# Altium schematic sheet LED_aluminum.SchDoc: Sample Sheet Title
size B; Date: MM/DD/YYYY; Author: Sample Author; Organization: ORGANIZATION; Address1: ADDRESS 1; Address2: ADDRESS 2; Address3: ADDRESS 3; Address4: ADDRESS 4; Revision: -; SheetNumber: 1; SheetTotal: 1; ENG_APP_DATE: --/--/--; DSN_APP_DATE: --/--/--; CHK_APP_DATE: --/--/--
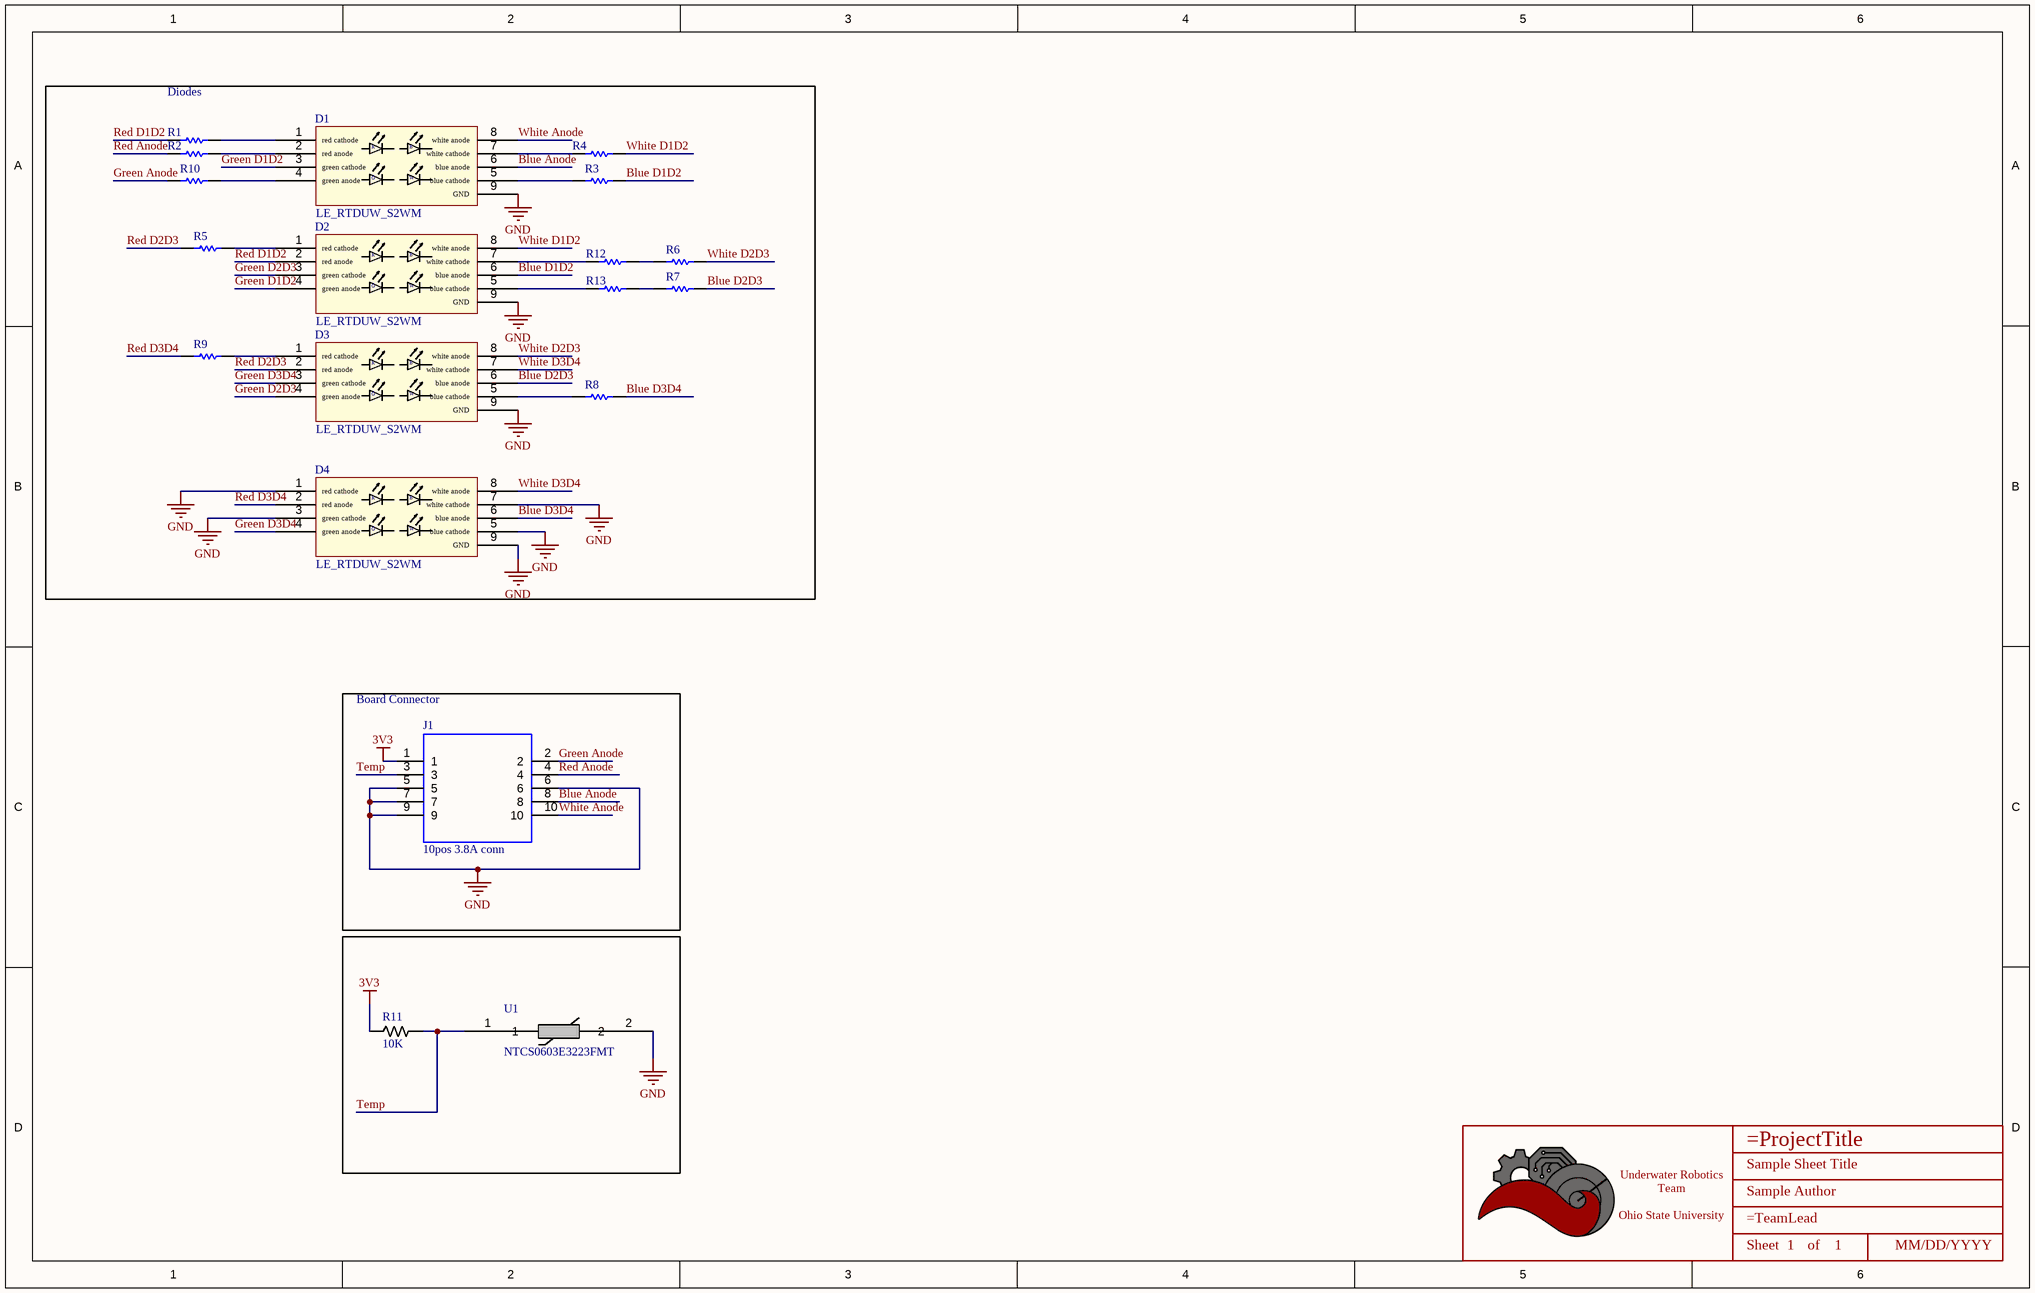
[diagram p0: LED_aluminum.SchDoc]

## Parts
*  Title_Block  [LOGO]  (value not drawn)  (graphical)
D1  LE_RTDUW_S2WM  [LE_RTDUW_S2WM]
D2  LE_RTDUW_S2WM  [LE_RTDUW_S2WM]
D3  LE_RTDUW_S2WM  [LE_RTDUW_S2WM]
D4  LE_RTDUW_S2WM  [LE_RTDUW_S2WM]
J1  10pos 3.8A conn  [SAMTEC-LS2-105-01-X-D-RA2]
R1  Jumper 2512(6432)  [RESC2512(6432)_L]  (value not drawn)
R2  ERJ-8GEY0R00V  [RESC3216X70X50NL05T20]  (value not drawn)
R3  Jumper 2512(6432)  [RESC2512(6432)_L]  (value not drawn)
R4  ERJ-8GEY0R00V  [RESC3216X70X50NL05T20]  (value not drawn)
R5  Jumper 2512(6432)  [RESC2512(6432)_L]  (value not drawn)
R6  Jumper 2512(6432)  [RESC2512(6432)_L]  (value not drawn)
R7  ERJ-8GEY0R00V  [RESC3216X70X50NL05T20]  (value not drawn)
R8  ERJ-8GEY0R00V  [RESC3216X70X50NL05T20]  (value not drawn)
R9  ERJ-8GEY0R00V  [RESC3216X70X50NL05T20]  (value not drawn)
R10  ERJ-8GEY0R00V  [RESC3216X70X50NL05T20]  (value not drawn)
R11  Value  (Ohms): 10K  [RESISTOR_0603]  (hidden comment: 10k Ohm 0.5% 1/10W)
R12  ERJ-8GEY0R00V  [RESC3216X70X50NL05T20]  (value not drawn)
R13  Jumper 2512(6432)  [RESC2512(6432)_L]  (value not drawn)
U1  NTCS0603E3223FMT  [NTCS0603_VIS]

## Blocks framed on the sheet
Diodes: D1-D4 R1-R10 R12 R13
Board Connector: J1

## Nets
3V3: J1.1 R11.2
GND: D1.9(GND) D2.9(GND) D3.9(GND) D4.1(red_cathode) D4.3(green_cathode) D4.5(blue_cathode) D4.7(white_cathode) D4.9(GND) J1.5 J1.6 J1.7 J1.9 U1.2
Blue Anode: D1.6(blue_anode) J1.8
Blue D1D2: D2.6(blue_anode) R3.2
Blue D2D3: D3.6(blue_anode) R7.2
Blue D3D4: D4.6(blue_anode) R8.2
Green Anode: J1.2 R10.1
Green D1D2: D1.3(green_cathode) D2.4(green_anode)
Green D2D3: D2.3(green_cathode) D3.4(green_anode)
Green D3D4: D3.3(green_cathode) D4.4(green_anode)
Red Anode: J1.4 R2.1
Red D1D2: D2.2(red_anode) R1.1
Red D2D3: D3.2(red_anode) R5.1
Red D3D4: D4.2(red_anode) R9.1
Temp: J1.3 R11.1 U1.1
White Anode: D1.8(white_anode) J1.10
White D1D2: D2.8(white_anode) R4.2
White D2D3: D3.8(white_anode) R6.2
White D3D4: D3.7(white_cathode) D4.8(white_anode)
NetD1_1: D1.1(red_cathode) R1.2
NetD1_2: D1.2(red_anode) R2.2
NetD1_4: D1.4(green_anode) R10.2
NetD1_5: D1.5(blue_cathode) R3.1
NetD1_7: D1.7(white_cathode) R4.1
NetD2_1: D2.1(red_cathode) R5.2
NetD2_5: D2.5(blue_cathode) R13.1
NetD2_7: D2.7(white_cathode) R12.1
NetD3_1: D3.1(red_cathode) R9.2
NetD3_5: D3.5(blue_cathode) R8.1
NetR6_1: R6.1 R12.2
NetR7_1: R7.1 R13.2

## Notes on the sheet
- DWG. NO.
- REV.
- SHT.
- THIS DOCUMENT AND THE DATA DISCLOSED HEREIN OR HEREWITH IS THE PROPERTY OF ALTIUM LIMITED AND MAY BE FREELY DISTRIBUTED IN WHOLE. NO RIGHTS ARE RESERVED OR EXPRESS OR IMPLIED WARANTEE GIVEN.
- REVISION
- DESCRIPTION
- DATE
- APPROVED
- ENG:
- APPROVALS
- PROJECT
- DSN:
- CHK:
- REFERENCE DOCUMENTS
- PROJECT REVISION:
- TITLE
- DOCUMENT REVISION:
- DESIGN ITEM:
- BOM:
- FAB DWG:
- PCB DWG:
- ASSY DWG:
- SCALE:
- SIZE
- B
- CAGE CODE
- FILE NAME
- DWG NO.
- SHEET
- OF
- REV
- (in symbol LE_RTDUW_S2WM) R; B; G; W
- (in symbol Title_Block) Underwater Robotics Team / Ohio State University; Sheet; of

## Library data of the parts
* = Title_Block: UWRT Schematic Title Block Template / Created June 2021, Dylan Trainor
D1-D4 = LE_RTDUW_S2WM: LED OSTAR RGBW 625/527/453NM SMD; Supplier 1: Mouser; Supplier Part Number 1: 720-LERTDUWS2WMA2120
J1 = SAMTEC-LS2-105-01-X-D-RA2: 10 Position Connector Self Mating, Non-Gendered, Hermaphroditic Through Hole, Right Angle Gold; Package: None; Price: None; Value: *; MP: SAMTEC-LS2-105-01-X-D-RA2; Availability: Unavailable; Supplier 1: Mouser; Supplier Part Number 1: 200-LS210501FDRA2
R1 R3 R5 R6 R13 = CMP-1018-00001-1: Jumper 2512 (6432 Metric); Tolerance: None; Case-EIA: 2512; Value: 0.00 Ohm; Case-Metric: 6432; Technology: SMT; Power: None
R2 R4 R7-R10 R12 = CMP-2003-00541-1: Manufacturer: Panasonic; Part Number: ERJ-8GEY0R00V
R11 = RESISTOR_10K_0.5%_0603: RES 10k OHM 0.5% 1/10W 0603; Tolerance: +/- 0.5%; Made By: Robert Pafford; Wattage: 1/10W; Supplier: Digikey; Digikey Part Numer: CR0603-JW-104ELFTR-ND; Supplier 1: Digi-Key; Supplier Part Number 1: 749-1695-1-ND
U1 = CMP-00030-42631939-1: NTCS0603E3223FMT Thermistor NTC 22K Ohm 1% 2-Pin 0603 Surface Mount Solder Pad 3730K -4.5 to -4 T/R Automotive; Resistance: 22kΩ; Power Dissipation: 125mW; Contact Plating: Tin; Accuracy: 1%; Height: 800µm; Max Operating Temperature: 150°C; Termination: SMD/SMT; Case Code (Imperial): 0603; Mount: Surface Mount; Case/Package: 0603; Radiation Hardening: No; Schedule B: 8533400080, 8533400080; Min Operating Temperature: -40°C; Case Code (Metric): 1608; RoHS: Compliant; NexarPartId: 42631939; Number of Pins: 2; Depth: 800µm; Length: 1.6mm; Power Rating: 125mW; Tolerance: 1%; REACH SVHC: Unknown; Width: 1.6mm